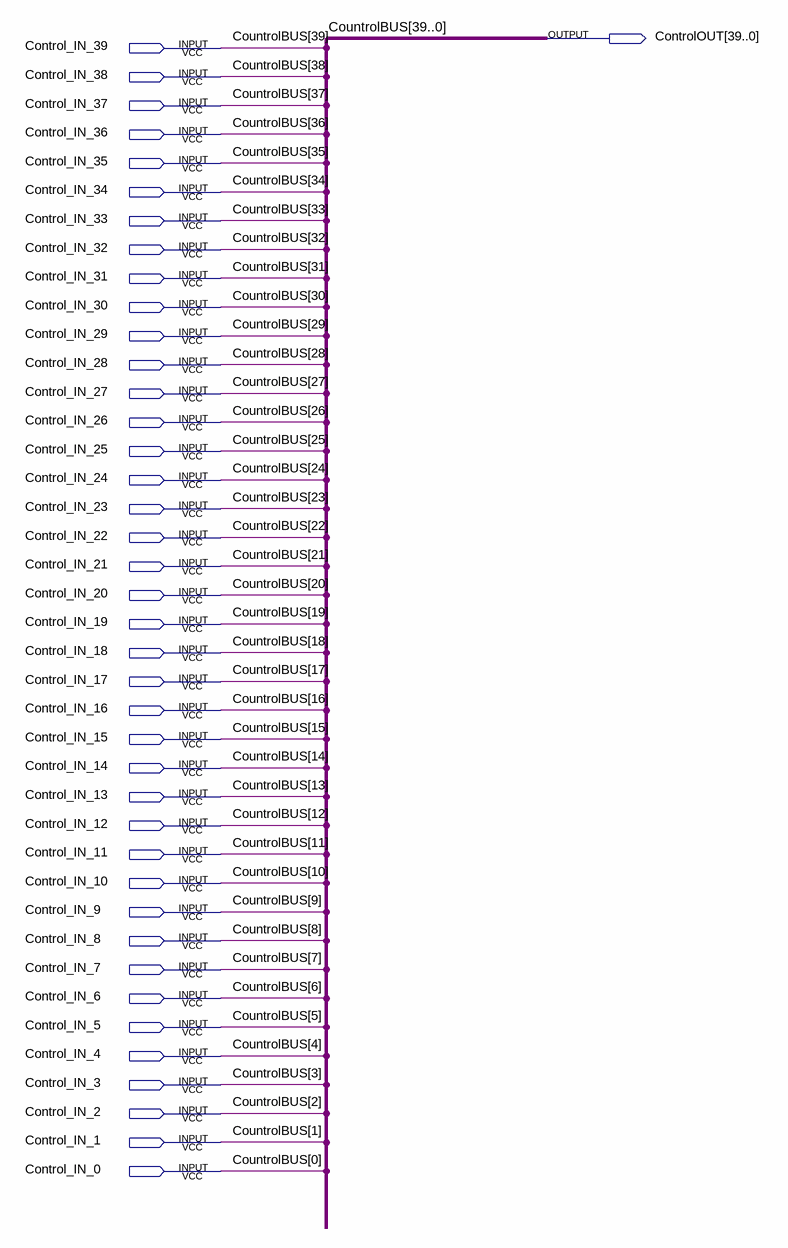
[diagram p0: schematic sheet]
// Quartus schematic Counduit2Bus.bdf as structural Verilog: 0 symbols, 41 pins
module Counduit2Bus (
  input  Control_IN_39,
  input  Control_IN_38,
  input  Control_IN_37,
  input  Control_IN_36,
  input  Control_IN_35,
  input  Control_IN_34,
  input  Control_IN_33,
  input  Control_IN_32,
  input  Control_IN_31,
  input  Control_IN_30,
  input  Control_IN_29,
  input  Control_IN_28,
  input  Control_IN_27,
  input  Control_IN_26,
  input  Control_IN_25,
  input  Control_IN_24,
  input  Control_IN_23,
  input  Control_IN_22,
  input  Control_IN_21,
  input  Control_IN_20,
  input  Control_IN_19,
  input  Control_IN_18,
  input  Control_IN_17,
  input  Control_IN_16,
  input  Control_IN_15,
  input  Control_IN_14,
  input  Control_IN_13,
  input  Control_IN_12,
  input  Control_IN_11,
  input  Control_IN_10,
  input  Control_IN_9,
  input  Control_IN_8,
  input  Control_IN_7,
  input  Control_IN_6,
  input  Control_IN_5,
  input  Control_IN_4,
  input  Control_IN_3,
  input  Control_IN_2,
  input  Control_IN_1,
  input  Control_IN_0,
  output [39:0] ControlOUT
);


  assign ControlOUT = {Control_IN_39, Control_IN_38, Control_IN_37, Control_IN_36, Control_IN_35, Control_IN_34, Control_IN_33, Control_IN_32, Control_IN_31, Control_IN_30, Control_IN_29, Control_IN_28, Control_IN_27, Control_IN_26, Control_IN_25, Control_IN_24, Control_IN_23, Control_IN_22, Control_IN_21, Control_IN_20, Control_IN_19, Control_IN_18, Control_IN_17, Control_IN_16, Control_IN_15, Control_IN_14, Control_IN_13, Control_IN_12, Control_IN_11, Control_IN_10, Control_IN_9, Control_IN_8, Control_IN_7, Control_IN_6, Control_IN_5, Control_IN_4, Control_IN_3, Control_IN_2, Control_IN_1, Control_IN_0};

  // Other names for the same wires on the sheet: CountrolBUS[39:0] = {Control_IN_39, Control_IN_38, Control_IN_37, Control_IN_36, Control_IN_35, Control_IN_34, Control_IN_33, Control_IN_32, Control_IN_31, Control_IN_30, Control_IN_29, Control_IN_28, Control_IN_27, Control_IN_26, Control_IN_25, Control_IN_24, Control_IN_23, Control_IN_22, Control_IN_21, Control_IN_20, Control_IN_19, Control_IN_18, Control_IN_17, Control_IN_16, Control_IN_15, Control_IN_14, Control_IN_13, Control_IN_12, Control_IN_11, Control_IN_10, Control_IN_9, Control_IN_8, Control_IN_7, Control_IN_6, Control_IN_5, Control_IN_4, Control_IN_3, Control_IN_2, Control_IN_1, Control_IN_0}
endmodule
